# Altium project Farming_PCB.PrjPcb
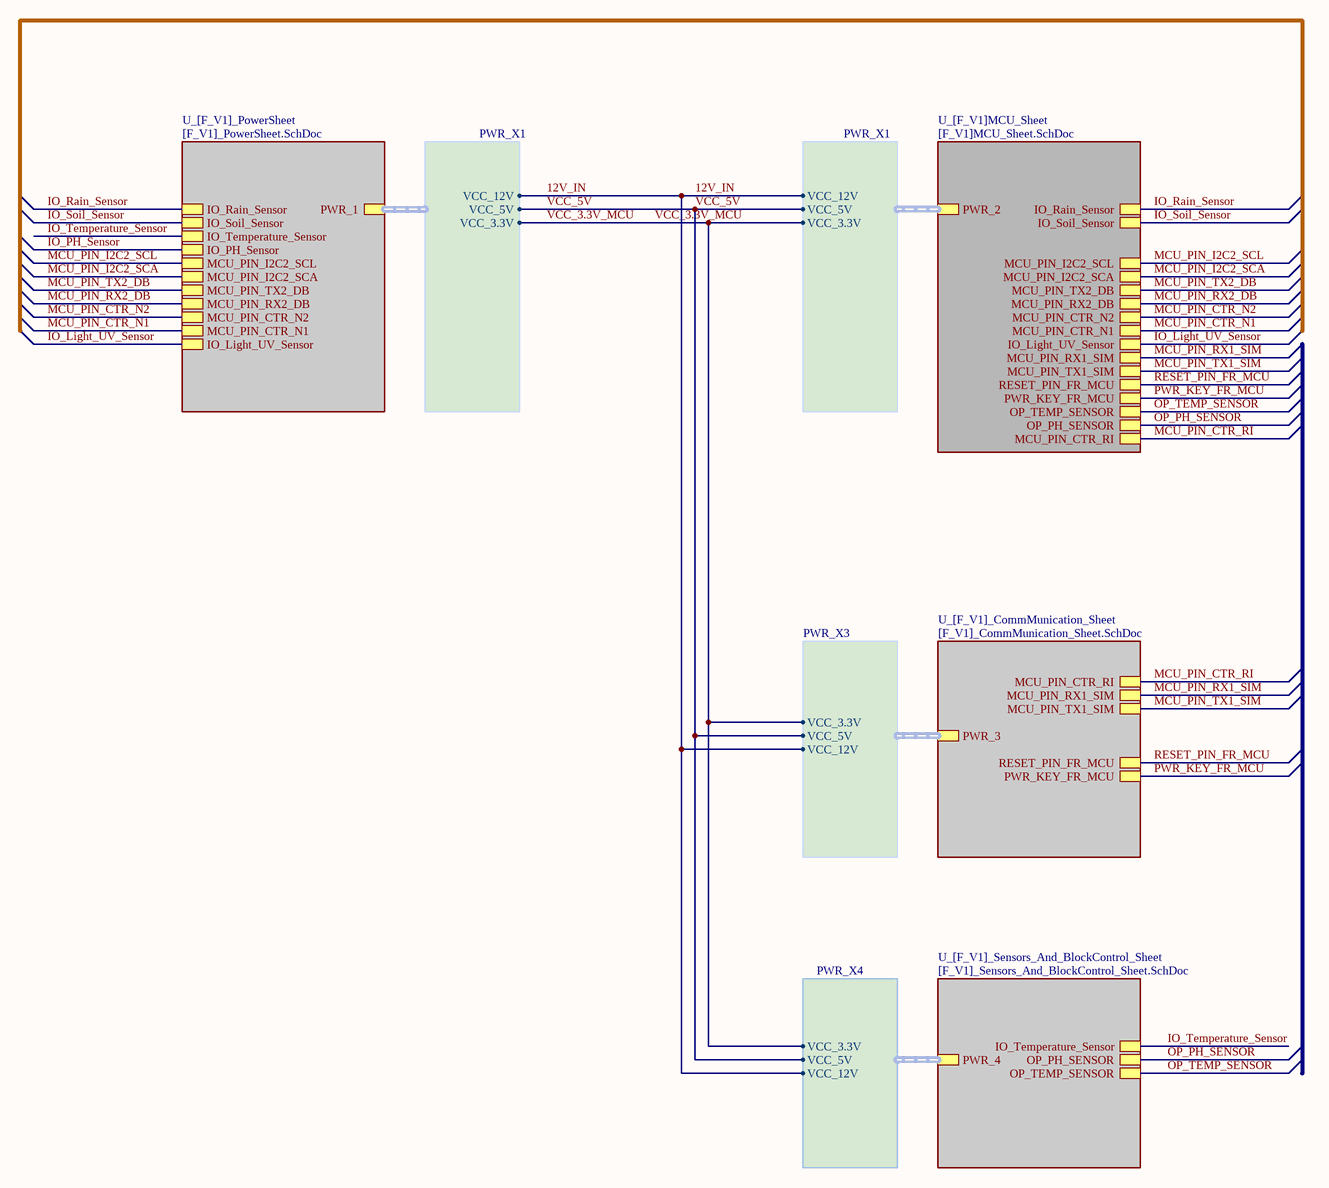
[diagram p0: Main_Sheet.SchDoc]
5 sheets, 147 parts. Net scope: hierarchical (ports join the sheet entries above them; power ports are global).
Board file: FM_V0.1.PcbDoc
Sheets:
  Main_Sheet.SchDoc
    U_[F_V1]_PowerSheet = [F_V1]_PowerSheet.SchDoc
    U_[F_V1]MCU_Sheet = [F_V1]MCU_Sheet.SchDoc
    U_[F_V1]_CommMunication_Sheet = [F_V1]_CommMunication_Sheet.SchDoc
    U_[F_V1]_Sensors_And_BlockControl_Sheet = [F_V1]_Sensors_And_BlockControl_Sheet.SchDoc

## Sheet Main_Sheet.SchDoc
size A3; SheetNumber: 1; SheetTotal: 5

### Sub-sheets
U_[F_V1]_CommMunication_Sheet = [F_V1]_CommMunication_Sheet.SchDoc: PWR_3 (harness PWR_X3), MCU_PIN_RX1_SIM, MCU_PIN_TX1_SIM, PWR_KEY_FR_MCU, RESET_PIN_FR_MCU, MCU_PIN_CTR_RI
U_[F_V1]_PowerSheet = [F_V1]_PowerSheet.SchDoc: IO_Rain_Sensor, IO_Temperature_Sensor, IO_PH_Sensor, IO_Light_UV_Sensor, PWR_1 (harness PWR_X1), IO_Soil_Sensor, MCU_PIN_CTR_N1, MCU_PIN_CTR_N2, MCU_PIN_I2C2_SCA, MCU_PIN_I2C2_SCL, MCU_PIN_TX2_DB, MCU_PIN_RX2_DB
U_[F_V1]_Sensors_And_BlockControl_Sheet = [F_V1]_Sensors_And_BlockControl_Sheet.SchDoc: PWR_4 (harness PWR_X4), IO_Temperature_Sensor, OP_PH_SENSOR, OP_TEMP_SENSOR
U_[F_V1]MCU_Sheet = [F_V1]MCU_Sheet.SchDoc: IO_Rain_Sensor, OP_TEMP_SENSOR, OP_PH_SENSOR, IO_Light_UV_Sensor, PWR_2 (harness PWR_X1), IO_Soil_Sensor, MCU_PIN_RX2_DB, MCU_PIN_I2C2_SCL, MCU_PIN_I2C2_SCA, MCU_PIN_TX2_DB, MCU_PIN_CTR_N1, MCU_PIN_CTR_N2, MCU_PIN_RX1_SIM, MCU_PIN_TX1_SIM, RESET_PIN_FR_MCU, PWR_KEY_FR_MCU, MCU_PIN_CTR_RI

### Harnesses
PWR_X1: VCC_12V, VCC_5V, VCC_3.3V
PWR_X3: VCC_12V, VCC_5V, VCC_3.3V
PWR_X4: VCC_12V, VCC_5V, VCC_3.3V

### Nets
12V_IN: sheet U_[F_V1]_PowerSheet/PWR_1.VCC_12V, sheet U_[F_V1]MCU_Sheet/PWR_2.VCC_12V, sheet U_[F_V1]_CommMunication_Sheet/PWR_3.VCC_12V, sheet U_[F_V1]_Sensors_And_BlockControl_Sheet/PWR_4.VCC_12V
IO_Light_UV_Sensor: sheet U_[F_V1]_PowerSheet/IO_Light_UV_Sensor, sheet U_[F_V1]MCU_Sheet/IO_Light_UV_Sensor
IO_PH_Sensor: sheet U_[F_V1]_PowerSheet/IO_PH_Sensor
IO_Rain_Sensor: sheet U_[F_V1]_PowerSheet/IO_Rain_Sensor, sheet U_[F_V1]MCU_Sheet/IO_Rain_Sensor
IO_Soil_Sensor: sheet U_[F_V1]_PowerSheet/IO_Soil_Sensor, sheet U_[F_V1]MCU_Sheet/IO_Soil_Sensor
IO_Temperature_Sensor: sheet U_[F_V1]_PowerSheet/IO_Temperature_Sensor, sheet U_[F_V1]_Sensors_And_BlockControl_Sheet/IO_Temperature_Sensor
MCU_PIN_CTR_N1: sheet U_[F_V1]_PowerSheet/MCU_PIN_CTR_N1, sheet U_[F_V1]MCU_Sheet/MCU_PIN_CTR_N1
MCU_PIN_CTR_N2: sheet U_[F_V1]_PowerSheet/MCU_PIN_CTR_N2, sheet U_[F_V1]MCU_Sheet/MCU_PIN_CTR_N2
MCU_PIN_CTR_RI: sheet U_[F_V1]MCU_Sheet/MCU_PIN_CTR_RI, sheet U_[F_V1]_CommMunication_Sheet/MCU_PIN_CTR_RI
MCU_PIN_I2C2_SCA: sheet U_[F_V1]_PowerSheet/MCU_PIN_I2C2_SCA, sheet U_[F_V1]MCU_Sheet/MCU_PIN_I2C2_SCA
MCU_PIN_I2C2_SCL: sheet U_[F_V1]_PowerSheet/MCU_PIN_I2C2_SCL, sheet U_[F_V1]MCU_Sheet/MCU_PIN_I2C2_SCL
MCU_PIN_RX1_SIM: sheet U_[F_V1]MCU_Sheet/MCU_PIN_RX1_SIM, sheet U_[F_V1]_CommMunication_Sheet/MCU_PIN_RX1_SIM
MCU_PIN_RX2_DB: sheet U_[F_V1]_PowerSheet/MCU_PIN_RX2_DB, sheet U_[F_V1]MCU_Sheet/MCU_PIN_RX2_DB
MCU_PIN_TX1_SIM: sheet U_[F_V1]MCU_Sheet/MCU_PIN_TX1_SIM, sheet U_[F_V1]_CommMunication_Sheet/MCU_PIN_TX1_SIM
MCU_PIN_TX2_DB: sheet U_[F_V1]_PowerSheet/MCU_PIN_TX2_DB, sheet U_[F_V1]MCU_Sheet/MCU_PIN_TX2_DB
OP_PH_SENSOR: sheet U_[F_V1]MCU_Sheet/OP_PH_SENSOR, sheet U_[F_V1]_Sensors_And_BlockControl_Sheet/OP_PH_SENSOR
OP_TEMP_SENSOR: sheet U_[F_V1]MCU_Sheet/OP_TEMP_SENSOR, sheet U_[F_V1]_Sensors_And_BlockControl_Sheet/OP_TEMP_SENSOR
PWR_KEY_FR_MCU: sheet U_[F_V1]MCU_Sheet/PWR_KEY_FR_MCU, sheet U_[F_V1]_CommMunication_Sheet/PWR_KEY_FR_MCU
RESET_PIN_FR_MCU: sheet U_[F_V1]MCU_Sheet/RESET_PIN_FR_MCU, sheet U_[F_V1]_CommMunication_Sheet/RESET_PIN_FR_MCU
VCC_3.3V_MCU: sheet U_[F_V1]_PowerSheet/PWR_1.VCC_3.3V, sheet U_[F_V1]MCU_Sheet/PWR_2.VCC_3.3V, sheet U_[F_V1]_CommMunication_Sheet/PWR_3.VCC_3.3V, sheet U_[F_V1]_Sensors_And_BlockControl_Sheet/PWR_4.VCC_3.3V
VCC_5V: sheet U_[F_V1]_PowerSheet/PWR_1.VCC_5V, sheet U_[F_V1]MCU_Sheet/PWR_2.VCC_5V, sheet U_[F_V1]_CommMunication_Sheet/PWR_3.VCC_5V, sheet U_[F_V1]_Sensors_And_BlockControl_Sheet/PWR_4.VCC_5V  [project net VBATT]

## Sheet [F_V1]_PowerSheet.SchDoc
size A2; SheetNumber: 2; SheetTotal: 5
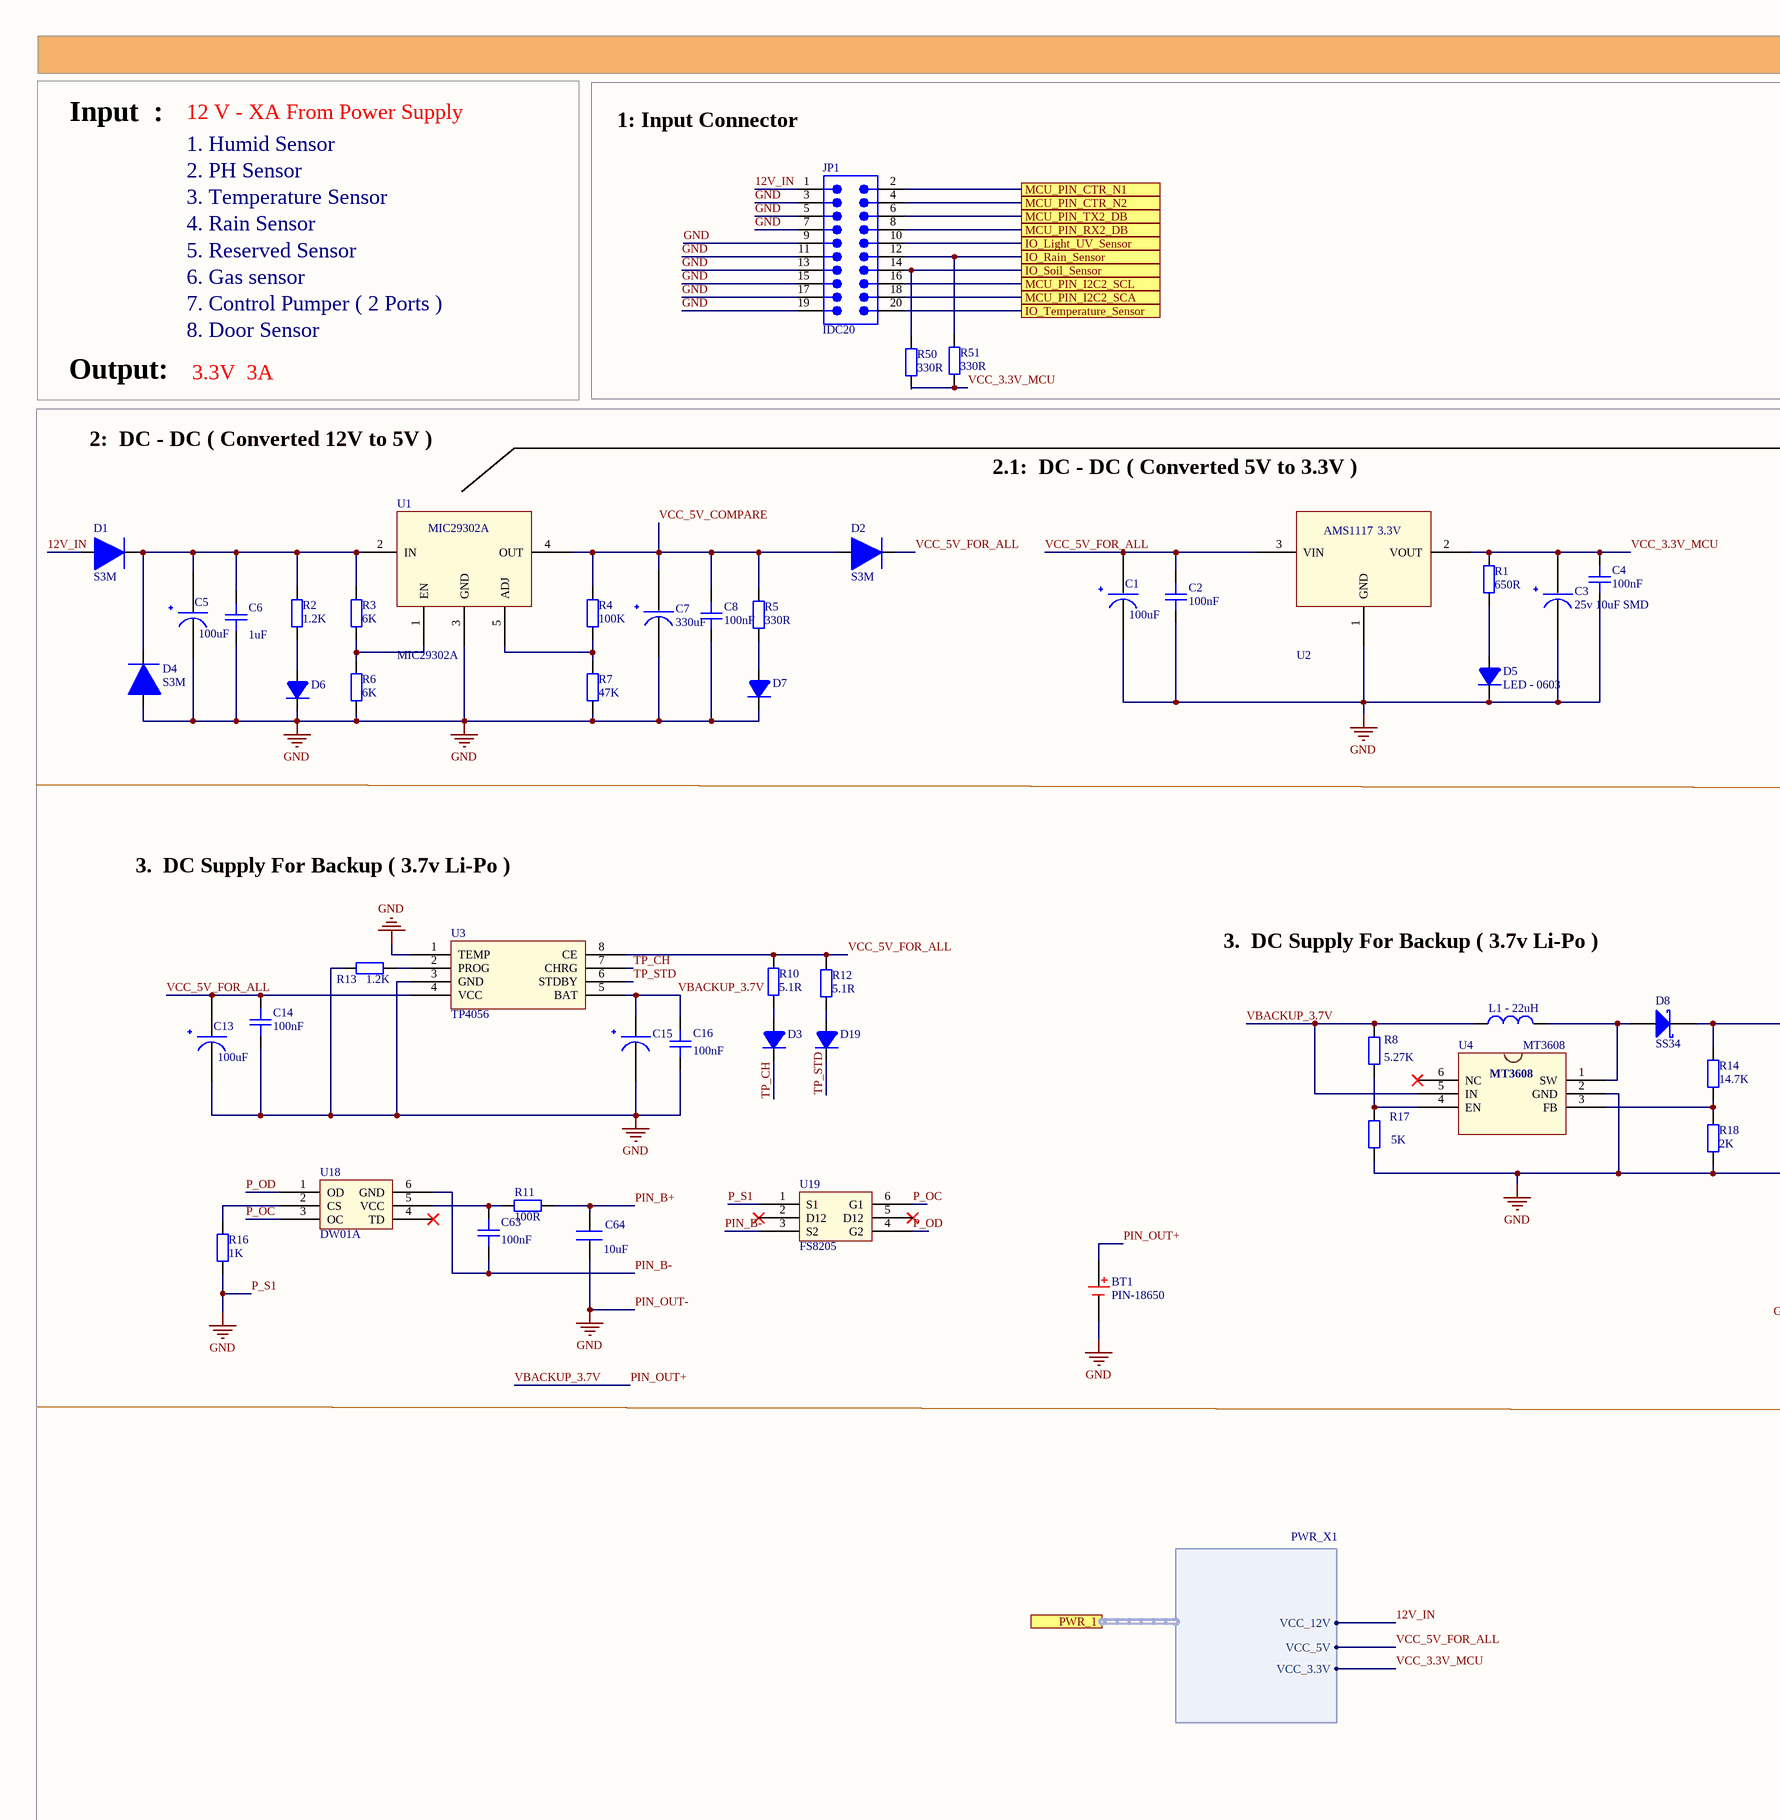
[diagram p1: [F_V1]_PowerSheet.SchDoc, left]
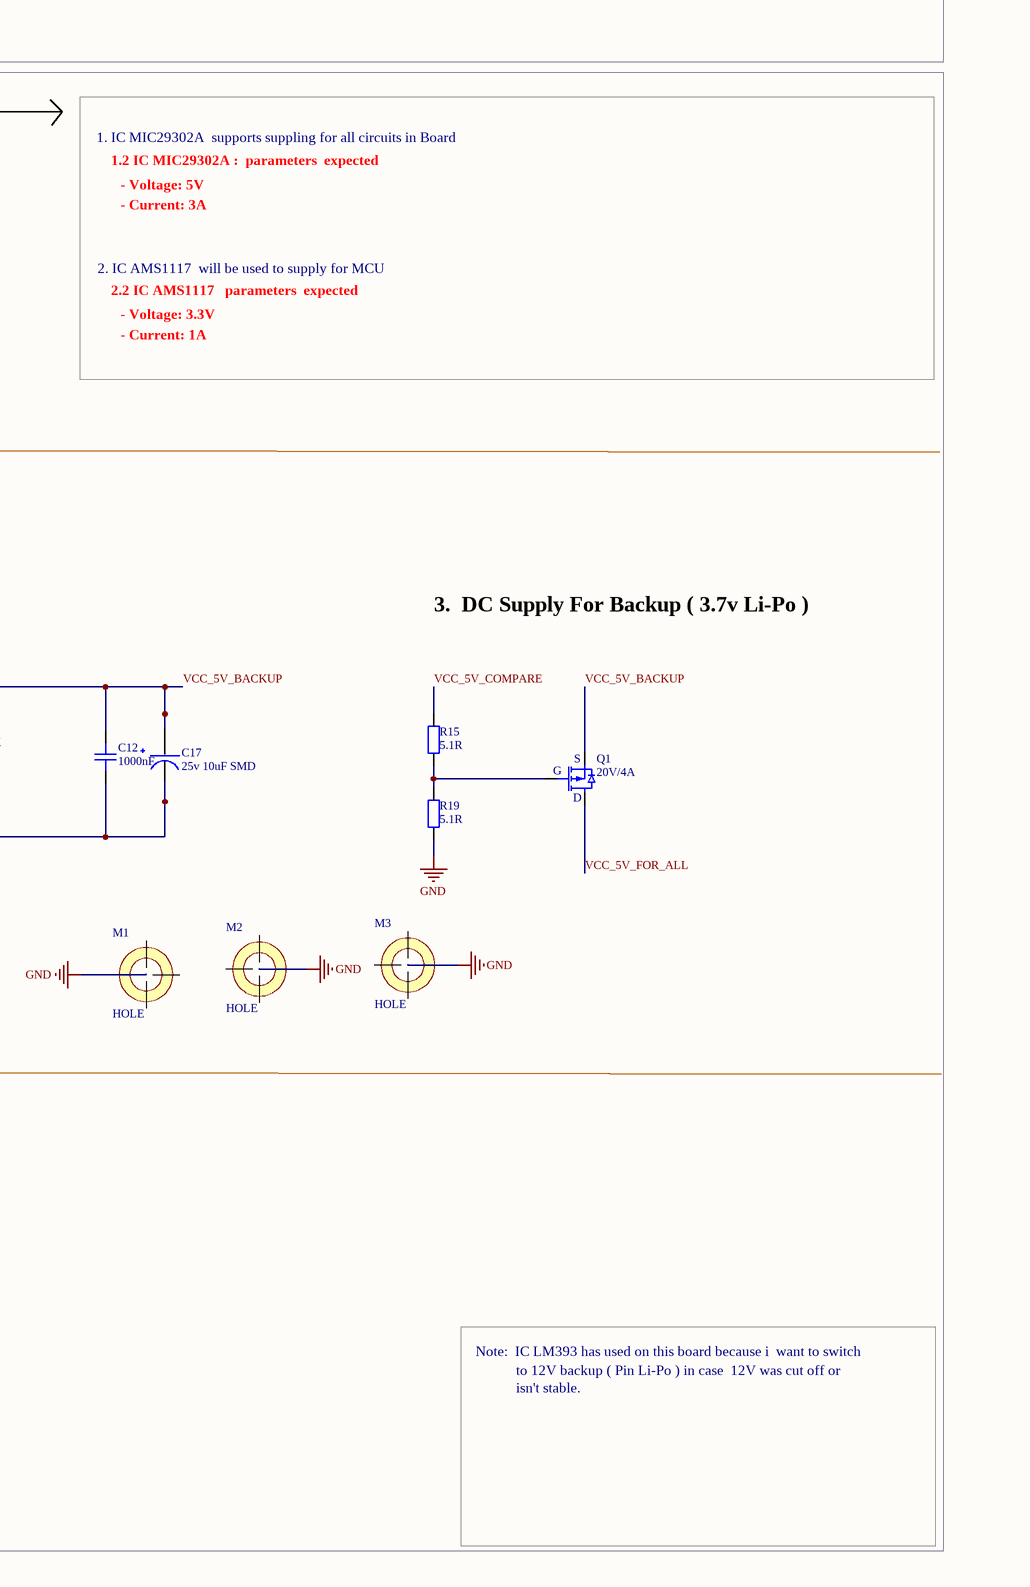
[diagram p2: [F_V1]_PowerSheet.SchDoc, right]

### Parts
(Parts that share a designator on the sheet are numbered #1, #2 ... from top to bottom, then left to right.)
BT1  PIN-18650  [PIN]
C1  100uF  [CAPACITOR 6.3x7.7mm]
C2  100nF  [CAPC-0603 (1608)]
C3  25v 10uF SMD  [CAPACITOR 4x5.4mm]
C4  100nF  [CAPC-0603 (1608)]
C5  100uF  [CAPACITOR 6.3x7.7mm]
C6  1uF  [CAPC-0603 (1608)]
C7  330uF  [CAPACITOR 8x10mm SMD]
C8  100nF  [CAPC-0603 (1608)]
C12  1000nF  [CAPC-0603 (1608)]
C13  100uF  [CAPACITOR 6.3x7.7mm]
C14  100nF  [CAPC-0603 (1608)]
C15  25v 10uF SMD  [CAPACITOR 4x5.4mm]  (value not drawn)
C16  100nF  [CAPC-0603 (1608)]
C17  25v 10uF SMD  [CAPACITOR 4x5.4mm]
C63  100nF  [CAPC-0603 (1608)]
C64  10uF  [CAP 10uF SMD 0805]
D1  S3M  [S3M]
D2  S3M  [S3M]
D3  LED - 0603  [LED - 0603]  (value not drawn)
D4  S3M  [S3M]
D5  LED - 0603  [LED - 0603]
D6  LED - 0603  [LED - 0603]  (value not drawn)
D7  LED - 0603  [LED - 0603]  (value not drawn)
D8  SS34  [DIODE_DO214AC_SMA]
D19  LED - 0603  [LED - 0603]  (value not drawn)
JP1#1  IDC20  [CAPBLE 20]
L1_-_22uH  L-22uH-0530  [INDUCTOR-0630-SMD]  (value not drawn)
M1  HOLE  [HOLE_2MM_5MM]  (no BOM)
M2  HOLE  [HOLE_2MM_5MM]  (no BOM)
M3  HOLE  [HOLE_2MM_5MM]  (no BOM)
Q1  20V/4A  [SOT23_3]
R1  650R  [RESC-0603 (1608)]
R2  1.2K  [RESC-0603 (1608)]
R3  6K  [RESC-0603 (1608)]
R4  100K  [RESC-0603 (1608)]
R5  330R  [RESC-0603 (1608)]
R6  6K  [RESC-0603 (1608)]
R7  47K  [RESC-0603 (1608)]
R8  5.27K  [RESC-0603 (1608)]
R10  5.1R  [RESC-0603 (1608)]
R11  100R  [RESC-0603 (1608)]
R12  5.1R  [RESC-0603 (1608)]
R13  1.2K  [RESC-0603 (1608)]
R14  14.7K  [RESC-0603 (1608)]
R15  5.1R  [RESC-0603 (1608)]
R16  1K  [RESC-0603 (1608)]
R17  5K  [RESC-0603 (1608)]
R18  2K  [RESC-0603 (1608)]
R19  5.1R  [RESC-0603 (1608)]
R50  330R  [RESC-0603 (1608)]
R51  330R  [RESC-0603 (1608)]
U1  MIC29302A  [MIC29302A]
U2  AMS1117 - 3.3V  [AMS1117 -3.3V]  (value not drawn)
U3  TP4056  [TP4056]
U4  MT3608  [MT3608]
U18  DW01A  [DW01A]
U19  FS8205  [FS8205]

### Blocks framed on the sheet
1: Input Connector: JP1#1 R50 R51

### Ports
IO_Light_UV_Sensor, IO_Rain_Sensor, IO_Soil_Sensor, IO_Temperature_Sensor, MCU_PIN_CTR_N1, MCU_PIN_CTR_N2, MCU_PIN_I2C2_SCA, MCU_PIN_I2C2_SCL, MCU_PIN_RX2_DB, MCU_PIN_TX2_DB, PWR_1 (harness PWR_X1)

### Harnesses
PWR_X1: VCC_12V, VCC_5V, VCC_3.3V

### Nets
GND: BT1.2 C1.2 C2.1 C3.2 C4.1 C5.2 C6.1 C7.2 C8.1 C12.1 C13.2 C14.1 C15.2 C16.1 C17.2 C64.1 D4.1(A) D5.2(K) D6.2(K) D7.2(K) JP1#1.3 JP1#1.5 JP1#1.7 JP1#1.9 JP1#1.11 JP1#1.13 JP1#1.15 JP1#1.17 JP1#1.19 R6.1 R7.1 R13.1 R16.2 R17.2 R18.2 R19.1 U1.3(GND) U2.1(GND) U3.1(TEMP) U3.3(GND) U4.2(GND) U19.1(S1)  [also labelled P_S1, PIN_OUT-]
12V_IN: D1.1(A) JP1#1.1 ; port PWR_1.VCC_12V
IO_Light_UV_Sensor: JP1#1.10 ; port IO_Light_UV_Sensor
IO_Rain_Sensor: JP1#1.12 R51.2 ; port IO_Rain_Sensor
IO_Soil_Sensor: JP1#1.14 R50.2 ; port IO_Soil_Sensor
IO_Temperature_Sensor: JP1#1.20 ; port IO_Temperature_Sensor
MCU_PIN_CTR_N1: JP1#1.2 ; port MCU_PIN_CTR_N1
MCU_PIN_CTR_N2: JP1#1.4 ; port MCU_PIN_CTR_N2
MCU_PIN_I2C2_SCA: JP1#1.18 ; port MCU_PIN_I2C2_SCA
MCU_PIN_I2C2_SCL: JP1#1.16 ; port MCU_PIN_I2C2_SCL
MCU_PIN_RX2_DB: JP1#1.8 ; port MCU_PIN_RX2_DB
MCU_PIN_TX2_DB: JP1#1.6 ; port MCU_PIN_TX2_DB
P_OC: U18.3(OC) U19.6(G1)
P_OD: U18.1(OD) U19.4(G2)
PIN_B+: C64.2 R11.2
PIN_B-: C63.1 U18.6(GND) U19.3(S2)
PIN_OUT+: BT1.1 C15.1 C16.2 L1_-_22uH.1 R8.1 U3.5(BAT) U4.5(IN)  [also labelled VBACKUP_3.7V]
TP_CH: D3.2(K) U3.7(CHRG)
TP_STD: D19.2(K) U3.6(STDBY)
VCC_3.3V_MCU: C3.1 C4.2 R1.2 R50.1 R51.1 U2.2(VOUT) ; port PWR_1.VCC_3.3V
VCC_5V_BACKUP: C12.2 C17.1 D8.2(K) Q1.2(S) R14.1
VCC_5V_COMPARE: C7.1 C8.2 D2.1(A) R4.1 R5.2 R15.1 U1.4(OUT)
VCC_5V_FOR_ALL: C1.1 C2.2 C13.1 C14.2 D2.2(K) Q1.3(D) R10.2 R12.2 U2.3(VIN) U3.4(VCC) U3.8(CE) ; port PWR_1.VCC_5V  [project net VBATT]
NetC5_1: C5.1 C6.2 D1.2(K) D4.2(K) R2.2 R3.1 U1.2(IN)
NetC63_2: C63.2 R11.1 U18.5(VCC)
NetD3_1: D3.1(A) R10.1
NetD5_1: D5.1(A) R1.1
NetD6_1: D6.1(A) R2.1
NetD7_1: D7.1(A) R5.1
NetD8_1: D8.1(A) L1_-_22uH.2 U4.1(SW)
NetD19_1: D19.1(A) R12.1
NetQ1_1: Q1.1(G) R15.2 R19.2
NetR3_2: R3.2 R6.2 U1.1(EN)
NetR4_2: R4.2 R7.2 U1.5(ADJ)
NetR8_2: R8.2 R17.1 U4.4(EN)
NetR13_2: R13.2 U3.2(PROG)
NetR14_2: R14.2 R18.1 U4.3(FB)
NetR16_1: R16.1 U18.2(CS)

Not connected (* = marked no-connect by the designer): U4 6(NC)*; U18 4(TD)*; U19 2(D12)* 5(D12)*

### Notes on the sheet
- Input  :
- 12 V - XA From Power Supply
- 1. Humid Sensor
- 2. PH Sensor
- 3. Temperature Sensor
- 4. Rain Sensor
- 5. Reserved Sensor
- 6. Gas sensor
- 7. Control Pumper ( 2 Ports )
- Output:
- 8. Door Sensor
- 3.3V  3A
- 2:  DC - DC ( Converted 12V to 5V )
- 2.1:  DC - DC ( Converted 5V to 3.3V )
- 1. IC MIC29302A  supports suppling for all circuits in Board
- 1.2 IC MIC29302A :  parameters  expected
- - Voltage: 5V
- - Current: 3A
- 2. IC AMS1117  will be used to supply for MCU
- 2.2 IC AMS1117   parameters  expected
- - Voltage: 3.3V
- - Current: 1A
- 3.  DC Supply For Backup ( 3.7v Li-Po )
- Note:  IC LM393 has used on this board because i  want to switch
- to 12V backup ( Pin Li-Po ) in case  12V was cut off or
- isn't stable.
- (in symbol AMS1117 - 3.3V) AMS1117; 3.3V

### Library data of the parts
C1 C5 C13 = 25V 100uF SMD
C2 C4 C6 C8 C12 C14 C16 C63 = CAPC NF 0603: CAP SMD, Not Fill, 0603; Value: NF; Solder: Not Fill; Category: CAPACITOR
C7 = 25V 330uF SMD
C64 = CAP 0805 10uF SMD
D8 = SS34: DIODE SCHOTTKY 40V 3A SMA; Solder: SMT; MPN: SS34; Value: SS34; MFR: *
JP1#1 = CAPBLE 20: Flat Cable Connector (IDC), Standard Male Header, Straight Press-in Pin, 20 Contacts, Performance Level 2; PCB_Layout: Complies with manufacturer's recommendation.; DrillSize: Corresponds to nominal value.; Published: 15-Nov-2004; PackageDocument: Feb-2000; PackageReference: 918520x329; Publisher: Altium Limited; ComponentLink1Description: Manufacturer Link; ComponentLink1URL: http://www.harting.com/; ComponentLink2Description: Packaging Specification; ComponentLink2URL: http://www.harkis.harting.com/_sek/pdf/TB_0918520x329_BL01_R32154.pdf
M1-M3 = HOLE_2_4/2_5/3_5/3_6: HOLE 2_4/2_5/3_5/3_6; MPN: None; Solder: Not Fill; CompanyID: VT-; ClassName: MECH_HOLE; Value: HOLE
Q1 = AO3415: MOSFET P-CH 20V 4A SOT23; MFR: Alpha & Omega Semiconductor Inc.; Solder: SMT; Value: 20V/4A; MPN: AO3415
R1-R8 R11 R13 R14 R16-R18 R50 R51 = CRCW06035R10FKEA: RES SMD 5.1 OHM 1% 1/10W 0603; MFR: Vishay Dale; Value: 5.1R; Solder: SMT; MPN: CRCW06035R10FKEA; Category: RESISTOR; PinCount: 2
R10 R12 R15 R19 = CRCW06035R10FKEA: RES SMD 5.1 OHM 1% 1/10W 0603; MFR: Vishay Dale; Solder: SMT; Value: 5.1R; MPN: CRCW06035R10FKEA; Category: RESISTOR; PinCount: 2

## Sheet [F_V1]MCU_Sheet.SchDoc
size A2; SheetNumber: 3; SheetTotal: 5
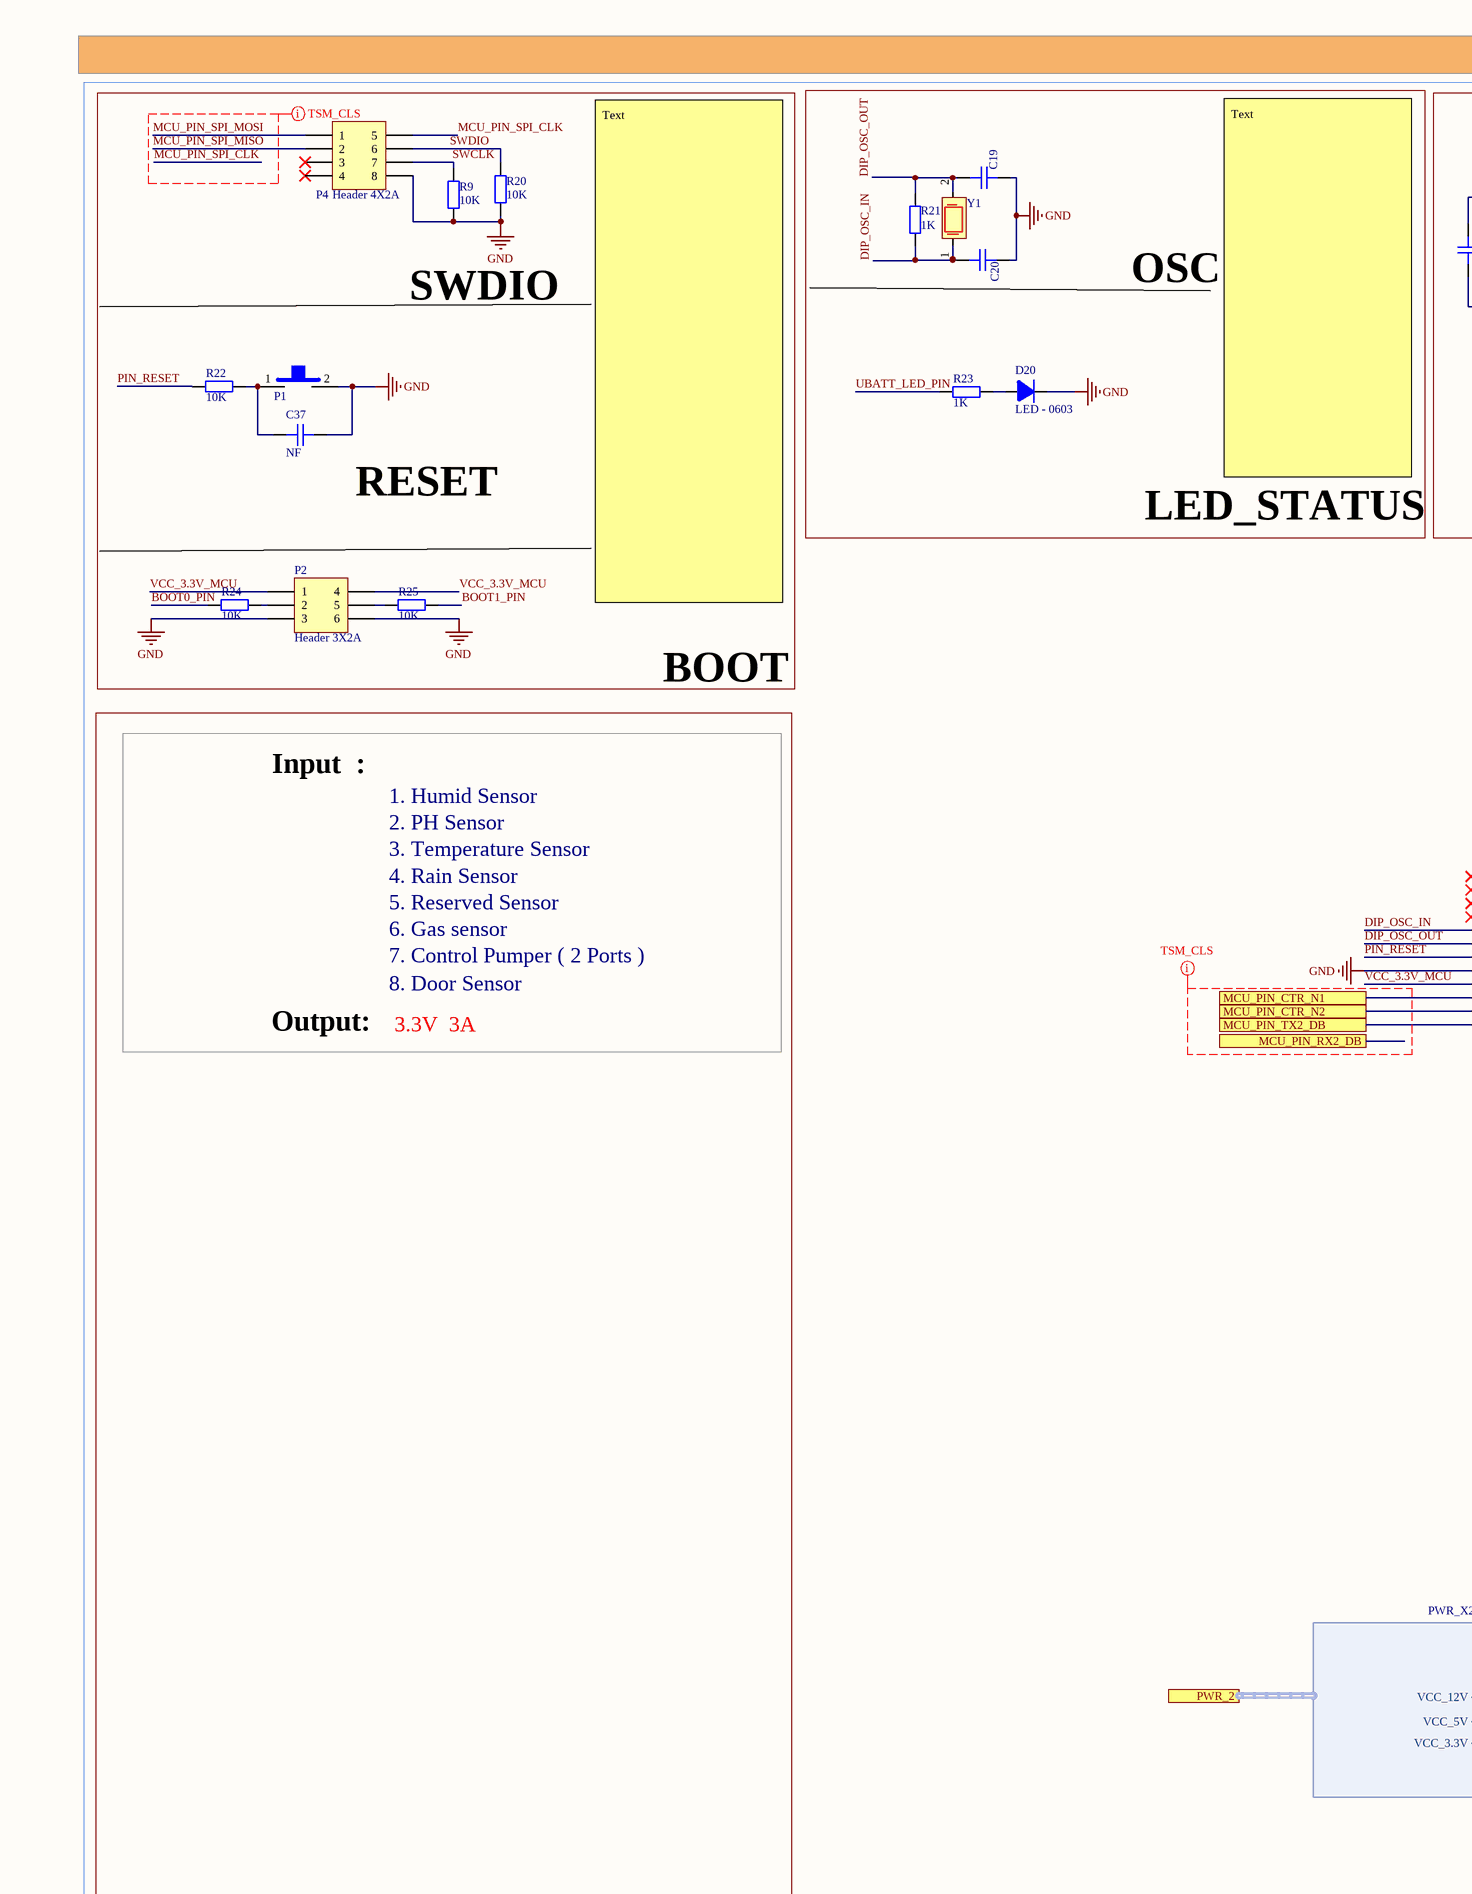
[diagram p3: [F_V1]MCU_Sheet.SchDoc, left]
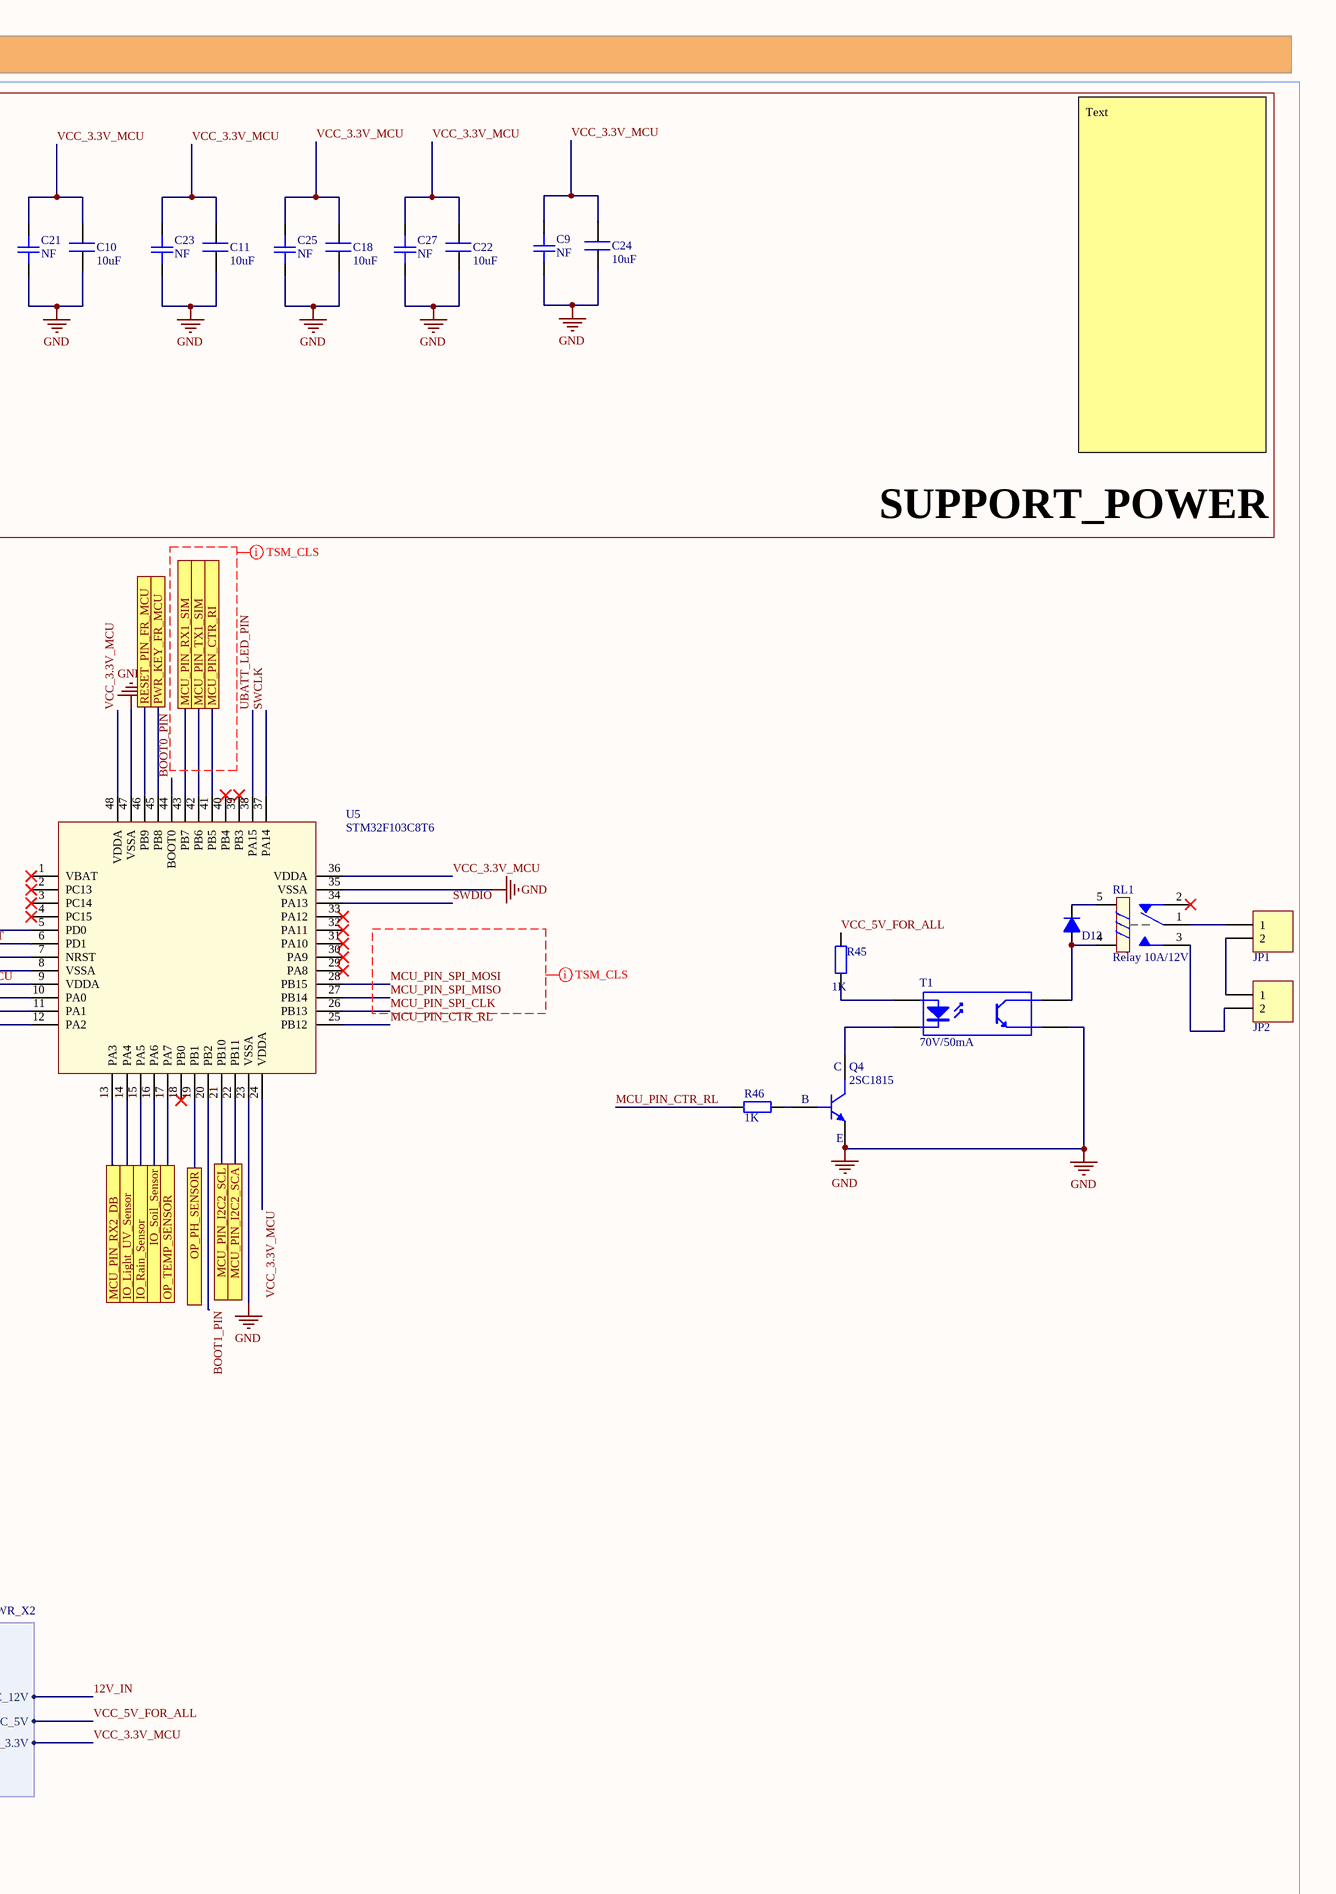
[diagram p4: [F_V1]MCU_Sheet.SchDoc, right]

### Parts
(Parts that share a designator on the sheet are numbered #1, #2 ... from top to bottom, then left to right.)
C9  NF  [CAPC-0603 (1608)]
C10  10uF  [CAP 10uF SMD 0805]
C11  10uF  [CAP 10uF SMD 0805]
C18  10uF  [CAP 10uF SMD 0805]
C19  NF  [CAPC-0603 (1608)]  (value not drawn)
C20  NF  [CAPC-0603 (1608)]  (value not drawn)
C21  NF  [CAPC-0603 (1608)]
C22  10uF  [CAP 10uF SMD 0805]
C23  NF  [CAPC-0603 (1608)]
C24  10uF  [CAP 10uF SMD 0805]
C25  NF  [CAPC-0603 (1608)]
C27  NF  [CAPC-0603 (1608)]
C37  NF  [CAPC-0603 (1608)]
D12  Diode  1N4007  [DO-214AC]  (value not drawn)
D20  LED - 0603  [LED - 0603]
JP1#2  Header 2_1  [HED2]  (value not drawn)
JP2  Header 2_1  [HED2]  (value not drawn)
P1  (no value)  [SW 2P SMD]
P2  Header 3X2A  [HDR2X3_CEN]
P4  Header 4X2A  [HDR2X4_CEN]
Q4  2SC1815  [SOT23_3]
R9  10K  [RESC-0603 (1608)]
R20  10K  [RESC-0603 (1608)]
R21  1K  [RESC-0603 (1608)]
R22  10K  [RESC-0603 (1608)]
R23  1K  [RESC-0603 (1608)]
R24  10K  [RESC-0603 (1608)]
R25  10K  [RESC-0603 (1608)]
R45  1K  [RESC-0603 (1608)]
R46  1K  [RESC-0603 (1608)]
RL1  Relay 10A/12V  [RL_SPDT_10A]
T1  70V/50mA  [OPTO TRANSISTOR_SMD-4]
U5  STM32F103C8T6  [STM32F103C8T6]
Y1  CRYSTAL - 8MHZ  [CRYSTAL - 8Mhz]  (value not drawn)

### Blocks framed on the sheet
SUPPORT_POWER: C9-C11 C18 C21-C25 C27

### Ports
IO_Light_UV_Sensor, IO_Rain_Sensor, IO_Soil_Sensor, MCU_PIN_CTR_N1, MCU_PIN_CTR_N2, MCU_PIN_CTR_RI, MCU_PIN_I2C2_SCA, MCU_PIN_I2C2_SCL, MCU_PIN_RX1_SIM, MCU_PIN_RX2_DB, MCU_PIN_TX1_SIM, MCU_PIN_TX2_DB, OP_PH_SENSOR, OP_TEMP_SENSOR, PWR_2 (harness PWR_X2), PWR_KEY_FR_MCU, RESET_PIN_FR_MCU

### Harnesses
PWR_X2: VCC_12V, VCC_5V, VCC_3.3V

### Nets
GND: C9.1 C10.1 C11.1 C18.1 C19.1 C20.1 C21.1 C22.1 C23.1 C24.1 C25.1 C27.1 C37.1 D20.2(K) P1.2 P2.3 P2.6 P4.8 Q4.2(E) R9.2 R20.2 T1.3 U5.8(VSSA) U5.23(VSSA) U5.35(VSSA) U5.47(VSSA)
BOOT0_PIN: R24.1 U5.44(BOOT0)
BOOT1_PIN: R25.2 U5.20(PB2)
DIP_OSC_IN: C20.2 R21.2 U5.5(PD0) Y1.1
DIP_OSC_OUT: C19.2 R21.1 U5.6(PD1) Y1.2
IO_Light_UV_Sensor: U5.14(PA4) ; port IO_Light_UV_Sensor
IO_Rain_Sensor: U5.15(PA5) ; port IO_Rain_Sensor
IO_Soil_Sensor: U5.16(PA6) ; port IO_Soil_Sensor
MCU_PIN_CTR_N1: U5.10(PA0) ; port MCU_PIN_CTR_N1
MCU_PIN_CTR_N2: U5.11(PA1) ; port MCU_PIN_CTR_N2
MCU_PIN_CTR_RI: U5.41(PB5) ; port MCU_PIN_CTR_RI
MCU_PIN_CTR_RL: R46.1 U5.25(PB12)
MCU_PIN_I2C2_SCA: U5.22(PB11) ; port MCU_PIN_I2C2_SCA
MCU_PIN_I2C2_SCL: U5.21(PB10) ; port MCU_PIN_I2C2_SCL
MCU_PIN_RX1_SIM: U5.43(PB7) ; port MCU_PIN_RX1_SIM
MCU_PIN_RX2_DB: U5.13(PA3) ; port MCU_PIN_RX2_DB
MCU_PIN_SPI_CLK: P4.5 U5.26(PB13)
MCU_PIN_SPI_MISO: P4.2 U5.27(PB14)
MCU_PIN_SPI_MOSI: P4.1 U5.28(PB15)
MCU_PIN_TX1_SIM: U5.42(PB6) ; port MCU_PIN_TX1_SIM
MCU_PIN_TX2_DB: U5.12(PA2) ; port MCU_PIN_TX2_DB
OP_PH_SENSOR: U5.19(PB1) ; port OP_PH_SENSOR
OP_TEMP_SENSOR: U5.17(PA7) ; port OP_TEMP_SENSOR
PIN_RESET: R22.1 U5.7(NRST)
PWR_KEY_FR_MCU: U5.45(PB8) ; port PWR_KEY_FR_MCU
RESET_PIN_FR_MCU: U5.46(PB9) ; port RESET_PIN_FR_MCU
SWCLK: P4.7 R9.1 U5.37(PA14)
SWDIO: P4.6 R20.1 U5.34(PA13)
UBATT_LED_PIN: R23.1 U5.38(PA15)
VCC_3.3V_MCU: C9.2 C10.2 C11.2 C18.2 C21.2 C22.2 C23.2 C24.2 C25.2 C27.2 P2.1 P2.4 U5.9(VDDA) U5.24(VDDA) U5.36(VDDA) U5.48(VDDA) ; port PWR_2.VCC_3.3V
VCC_5V_FOR_ALL: R45.1 ; port PWR_2.VCC_5V  [project net VBATT]
NetC37_2: C37.2 P1.1 R22.2
NetD12_A: D12.A RL1.4 T1.4
NetD12_K: D12.K RL1.5
NetD20_1: D20.1(A) R23.2
NetJP1#2_1: JP1#2.1 RL1.1
NetJP1#2_2: JP1#2.2 JP2.1
NetJP2_2: JP2.2 RL1.3
NetP2_2: P2.2 R24.2
NetP2_5: P2.5 R25.1
NetQ4_1: Q4.1(B) R46.2
NetQ4_3: Q4.3(C) T1.2
NetR45_2: R45.2 T1.1

Not connected (* = marked no-connect by the designer): P4 3* 4*; RL1 2*; U5 1(VBAT)* 2(PC13)* 3(PC14)* 4(PC15)* 18(PB0)* 29(PA8)* 30(PA9)* 31(PA10)* 32(PA11)* 33(PA12)* 39(PB3)* 40(PB4)*

### Layout directives
net class TSM_CLS: (no net found under the mark), MCU_PIN_SPI_CLK, MCU_PIN_SPI_MISO, MCU_PIN_SPI_MOSI

### Notes on the sheet
- OSC
- SWDIO
- Text
- (near C37) RESET
- LED_STATUS
- BOOT
- Input  :
- 1. Humid Sensor
- 2. PH Sensor
- 3. Temperature Sensor
- 4. Rain Sensor
- 5. Reserved Sensor
- 6. Gas sensor
- 7. Control Pumper ( 2 Ports )
- Output:
- 8. Door Sensor
- 3.3V  3A

### Library data of the parts
C9 C19-C21 C23 C25 C27 C37 = CAPC NF 0603: CAP SMD, Not Fill, 0603; Solder: Not Fill; Value: NF; Category: CAPACITOR
C10 C11 C18 C22 C24 = CAP 0805 10uF SMD
D12 = Diode  1N4007: Diode 1A; Value: 1N4007
JP1#2 JP2 = Header 2_1: Header, 2-Pin; Manufacturer: Generic Components; Class: Connector; Value: Header 2
P1 = Button 2 SMD: SMD Mini Push Button Switch 2 Pin 3x6x2.7mm; MPN: SMD Mini Push Button 2 SMD; Link: https://ram-e-shop.com/product/press2pin-smd/
P2 = Header 3X2A: Header, 3-Pin, Dual row; LatestRevisionDate: 17-Jul-2002; LatestRevisionNote: Re-released for DXP Platform.; Publisher: Altium Limited
P4 = Header 4X2A: Header, 4-Pin, Dual row; Solder: WAVE
Q4 = 2SC1815: TRANS NPN 50V 0.15A SOT23-3; Solder: SMT; MPN: 2SC1815; Value: 2SC1815
R9 R20-R25 R45 R46 = CRCW06035R10FKEA: as R1 on sheet [F_V1]_PowerSheet; MPN: CRCW06035R10FKEA; Category: RESISTOR; PinCount: 2
RL1 = Relay 1: Relay SPDT,10A - 12VDC 5 Pin; Value: Relay SPDT, 10A, 12V
T1 = HCPL-817-500E: OPTOISOLATOR 5KV TRANSISTOR 4SMD; Solder: SMT; CompanyID: VT-00147; Value: 70V/50mA; MPN: HCPL-817-500E

## Sheet [F_V1]_CommMunication_Sheet.SchDoc
size A2; SheetNumber: 4; SheetTotal: 5
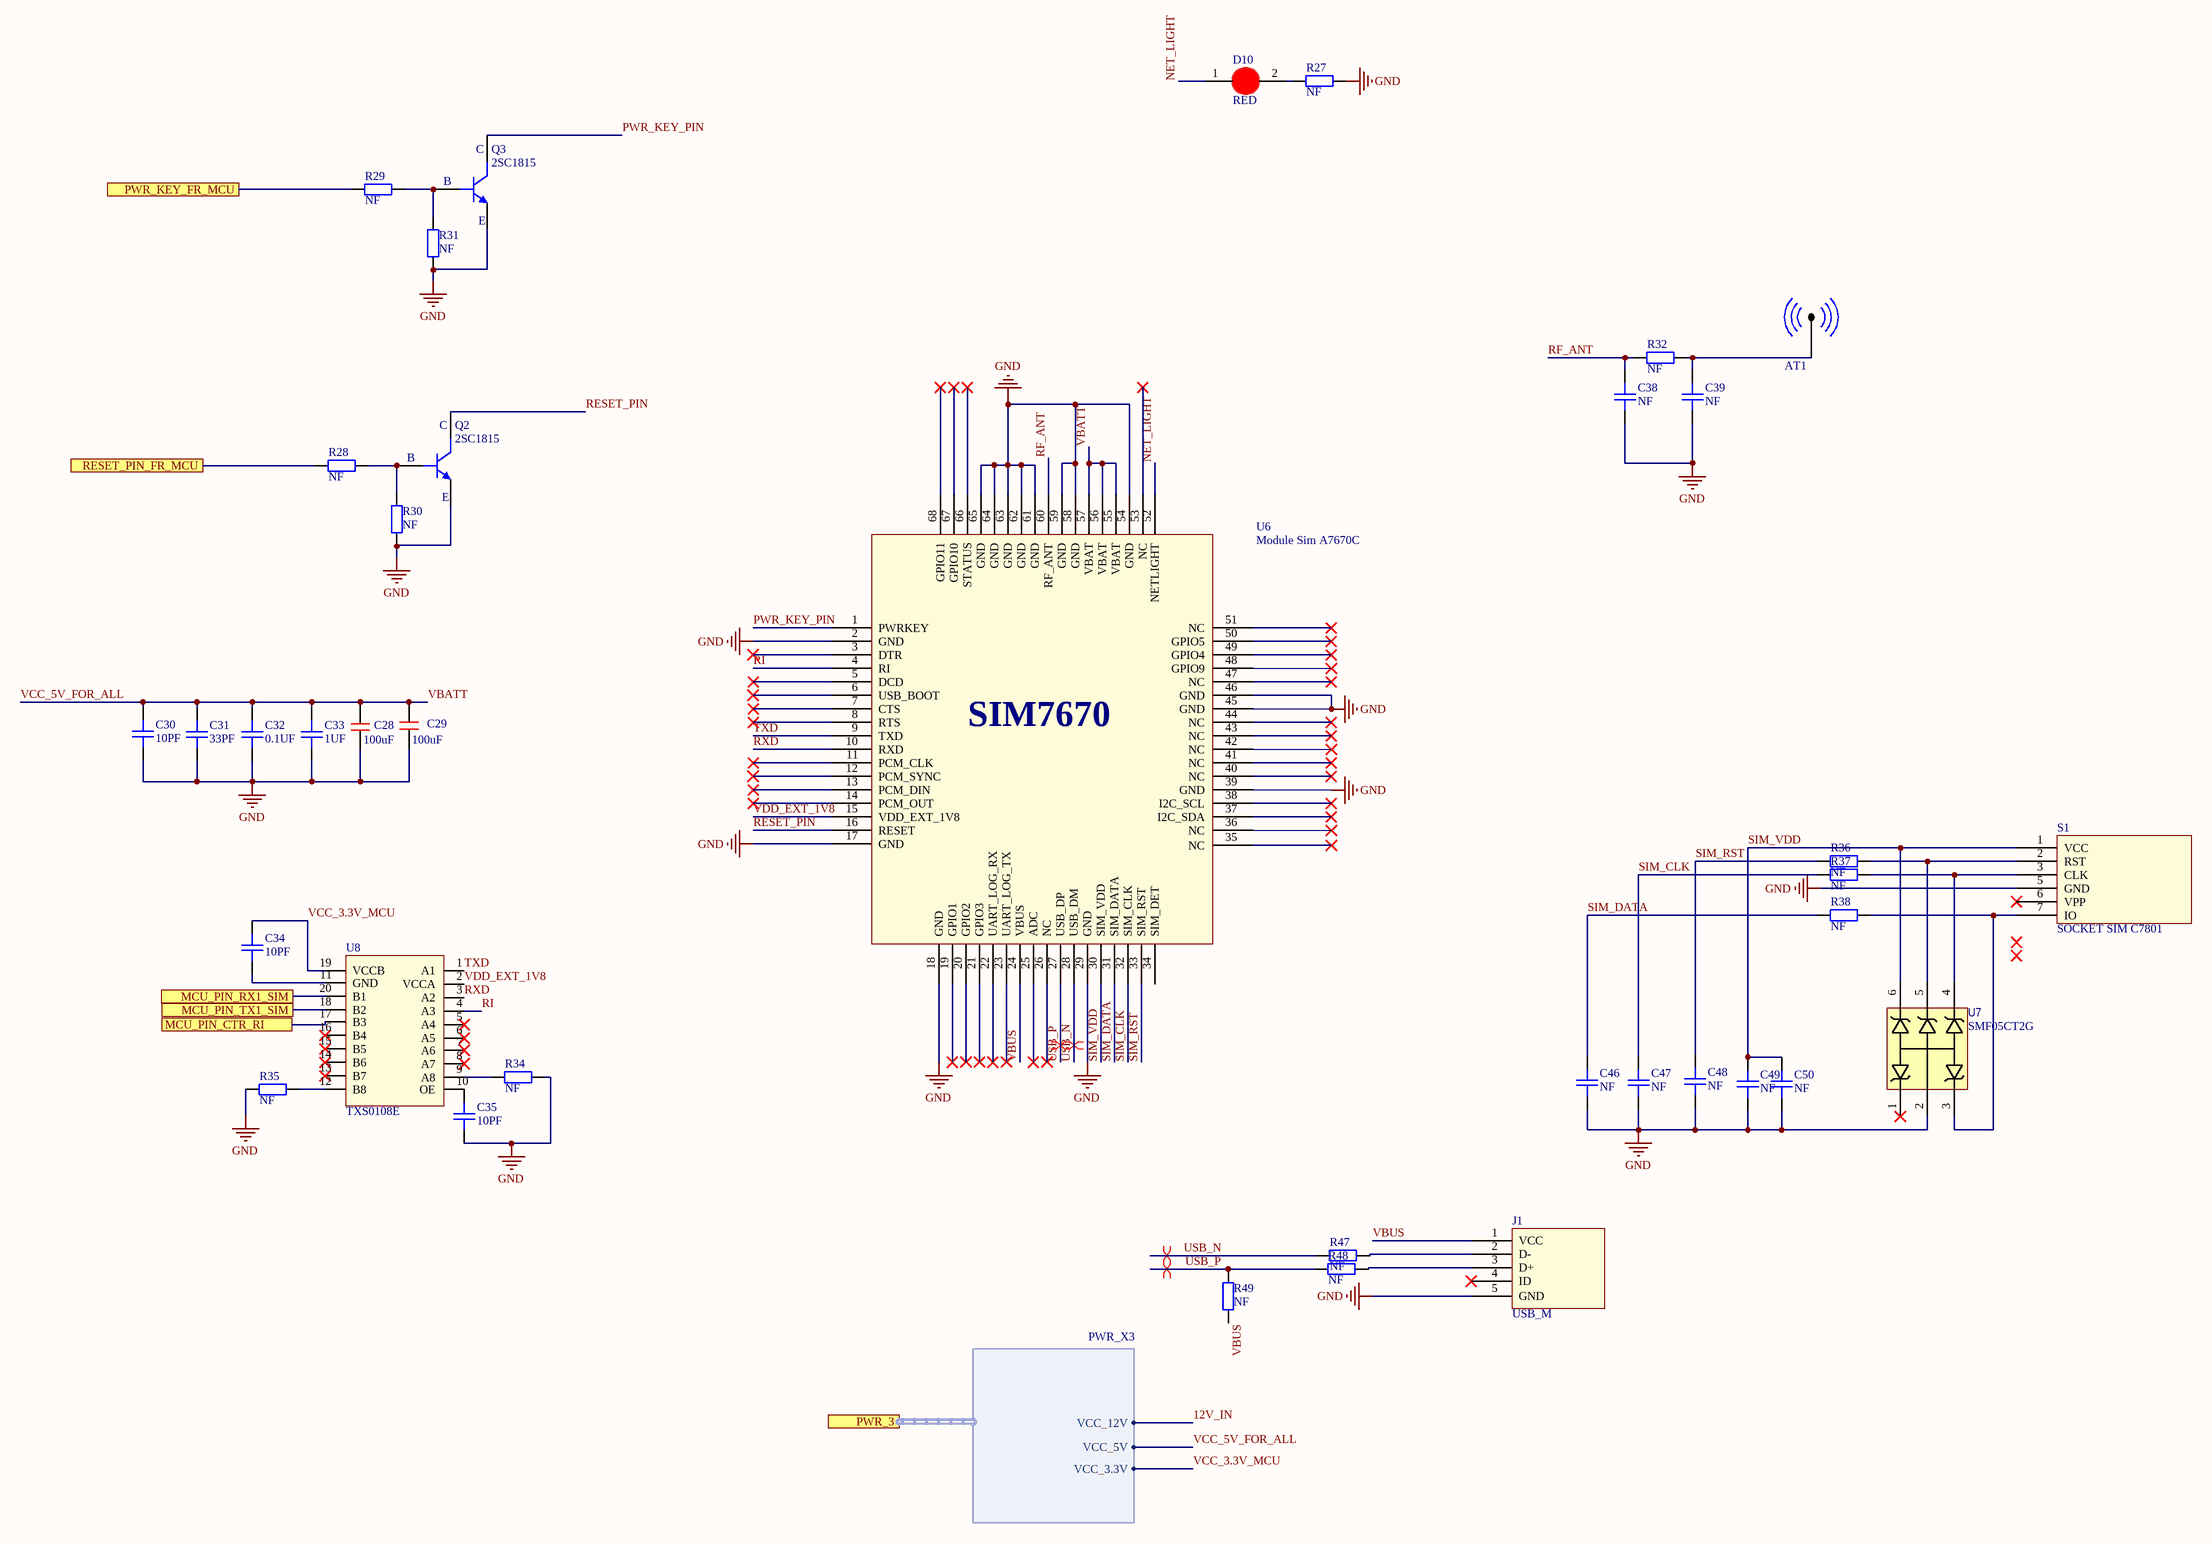
[diagram p5: [F_V1]_CommMunication_Sheet.SchDoc]

### Parts
AT1  AT-GSM-GPS  [ANTENA - SMA2]  (value not drawn)
C28  100uF  [100uF 1210 SMD]
C29  100uF  [100uF 1210 SMD]
C30  10PF  [CAPC-0603 (1608)]
C31  33PF  [CAPC-0603 (1608)]
C32  0.1UF  [CAPC-0603 (1608)]
C33  1UF  [CAPC-0603 (1608)]
C34  10PF  [CAPC-0603 (1608)]
C35  10PF  [CAPC-0603 (1608)]
C38  NF  [CAPC-0603 (1608)]
C39  NF  [CAPC-0603 (1608)]
C46  NF  [CAPC-0603 (1608)]
C47  NF  [CAPC-0603 (1608)]
C48  NF  [CAPC-0603 (1608)]
C49  NF  [CAPC-0603 (1608)]
C50  NF  [CAPC-0603 (1608)]
D10  RED  [LED_0603_RED]
J1  USB_M  [USB_M]
Q2  2SC1815  [SOT23_3]
Q3  2SC1815  [SOT23_3]
R27  NF  [RESC-0603 (1608)]
R28  NF  [RESC-0603 (1608)]
R29  NF  [RESC-0603 (1608)]
R30  NF  [RESC-0603 (1608)]
R31  NF  [RESC-0603 (1608)]
R32  NF  [RESC-0603 (1608)]
R34  NF  [RESC-0603 (1608)]
R35  NF  [RESC-0603 (1608)]
R36  NF  [RESC-0603 (1608)]
R37  NF  [RESC-0603 (1608)]
R38  NF  [RESC-0603 (1608)]
R47  NF  [RESC-0603 (1608)]
R48  NF  [RESC-0603 (1608)]
R49  NF  [RESC-0603 (1608)]
S1  SOCKET SIM C7801  [SOCKET SIM]
U6  Module Sim A7670C  [Module Sim A7670C]
U7  SMF05CT2G  [SOT65P210X140-6N]
U8  TXS0108E  [TXS0108E]

### Ports
MCU_PIN_CTR_RI, MCU_PIN_RX1_SIM, MCU_PIN_TX1_SIM, PWR_3 (harness PWR_X3), PWR_KEY_FR_MCU, RESET_PIN_FR_MCU

### Harnesses
PWR_X3: VCC_12V, VCC_5V, VCC_3.3V

### Nets
GND: C28.1 C29.1 C30.1 C31.1 C32.1 C33.1 C35.1 C38.1 C39.1 C46.1 C47.1 C48.1 C49.1 C50.1 J1.5(GND) Q2.2(E) Q3.2(E) R27.1 R30.2 R31.2 R34.1 R35.2 S1.5(GND) U6.2(GND) U6.17(GND) U6.18(GND) U6.29(GND) U6.39(GND) U6.45(GND) U6.46(GND) U6.54(GND) U6.58(GND) U6.59(GND) U6.61(GND) U6.62(GND) U6.63(GND) U6.64(GND) U6.65(GND) U7.2(AN)
MCU_PIN_CTR_RI: U8.17(B3) ; port MCU_PIN_CTR_RI
MCU_PIN_RX1_SIM: U8.20(B1) ; port MCU_PIN_RX1_SIM
MCU_PIN_TX1_SIM: U8.18(B2) ; port MCU_PIN_TX1_SIM
NET_LIGHT: D10.1(A) U6.52(NETLIGHT)
PWR_KEY_FR_MCU: R29.2 ; port PWR_KEY_FR_MCU
PWR_KEY_PIN: Q3.3(C) U6.1(PWRKEY)
RESET_PIN: Q2.3(C) U6.16(RESET)
RESET_PIN_FR_MCU: R28.2 ; port RESET_PIN_FR_MCU
RF_ANT: C38.2 R32.2 U6.60(RF_ANT)
RI: U6.4(RI) U8.4(A3)
RXD: U6.10(RXD) U8.3(A2)
SIM_CLK: C47.2 R37.2 U6.32(SIM_CLK)
SIM_DATA: C46.2 R38.2 U6.31(SIM_DATA)
SIM_RST: C48.2 R36.2 U6.33(SIM_RST)
SIM_VDD: C49.2 C50.2 S1.1(VCC) U6.30(SIM_VDD) U7.6(CT5)
TXD: U6.9(TXD) U8.1(A1)
USB_N: R47.2 U6.28(USB_DM)
USB_P: R48.2 R49.1 U6.27(USB_DP)
VBATT: C28.2 C29.2 C30.2 C31.2 C32.2 C33.2 U6.55(VBAT) U6.56(VBAT) U6.57(VBAT) ; port PWR_3.VCC_5V  [also labelled VCC_5V_FOR_ALL]
VBUS: J1.1(VCC) R49.2 U6.24(VBUS)
VCC_3.3V_MCU: C34.2 U8.19(VCCB) ; port PWR_3.VCC_3.3V
VDD_EXT_1V8: U6.15(VDD_EXT_1V8) U8.2(VCCA)
NetAT1_1: AT1.1(AT) C39.2 R32.1
NetC34_1: C34.1 U8.11(GND)
NetC35_2: C35.2 U8.10(OE)
NetD10_2: D10.2(K) R27.2
NetJ1_2: J1.2(D-) R47.1
NetJ1_3: J1.3(D+) R48.1
NetQ2_1: Q2.1(B) R28.1 R30.1
NetQ3_1: Q3.1(B) R29.1 R31.1
NetR34_2: R34.2 U8.9(A8)
NetR35_1: R35.1 U8.12(B8)
NetR36_1: R36.1 S1.2(RST) U7.5(CT4)
NetR37_1: R37.1 S1.3(CLK) U7.4(CT3)
NetR38_1: R38.1 S1.7(IO) U7.3(CT2)

Not connected (* = marked no-connect by the designer): AT1 2; J1 4(ID)*; S1 6(VPP)*; U6 3(DTR)* 5(DCD)* 6(USB_BOOT)* 7(CTS)* 8(RTS)* 11(PCM_CLK)* 12(PCM_SYNC)* 13(PCM_DIN)* 14(PCM_OUT)* 19(GPIO1)* 20(GPIO2)* 21(GPIO3)* 22(UART_LOG_RX)* 23(UART_LOG_TX)* 25(ADC)* 26(NC)* 34(SIM_DET) 35(NC)* 36(NC)* 37(I2C_SDA)* 38(I2C_SCL)* 40(NC)* 41(NC)* 42(NC)* 43(NC)* 44(NC)* 47(NC)* 48(GPIO9)* 49(GPIO4)* 50(GPIO5)* 51(NC)* 53(NC)* 66(STATUS)* 67(GPIO10)* 68(GPIO11)*; U7 1(CT1)*; U8 5(A4)* 6(A5)* 7(A6)* 8(A7)* 13(B7)* 14(B6)* 15(B5)* 16(B4)*

### Layout directives
differential pair; net class USB_CLS: USB_N, USB_P

### Notes on the sheet
- (in symbol Module Sim A7670C) SIM7670

### Library data of the parts
AT1 = RFCON171003SF6B001: CONNECTER ANTENNA GPS GSM; Solder: HAND; CompanyID: VT-00392; MPN: RFCON171003SF6B001; Value: AT-GSM-GPS
C28 C29 = CAP SMD 1210 100uF
C30-C35 = CAPC NF 0603: CAP SMD, Not Fill, 0603; Value: NF; Solder: Not Fill; Category: CAPACITOR
C38 C39 C46-C50 = CAPC NF 0603: CAP SMD, Not Fill, 0603; Solder: Not Fill; Value: NF; Category: CAPACITOR
D10 = LED RED 0603: LED RED 0603 SMD; Solder: SMT; Value: RED; Category: *
Q2 Q3 = 2SC1815: TRANS NPN 50V 0.15A SOT23-3; Solder: SMT; MPN: 2SC1815; Value: 2SC1815
R27-R32 R34-R38 R47-R49 = RESC NF 0603: RES SMD, Not Fill, 0603; Solder: Not Fill; Value: NF; Category: RESISTOR
U7 = SMF05C: TVS Diode Array For ESD and Latch-Up Protection; MFR: ON SEMICONDUCTOR; Solder: SMT; CompanyID: VT-0; MPN: SMF05CT2G; Category: IC; Value: SMF05CT2G

## Sheet [F_V1]_Sensors_And_BlockControl_Sheet.SchDoc
size A2; SheetNumber: 5; SheetTotal: 5
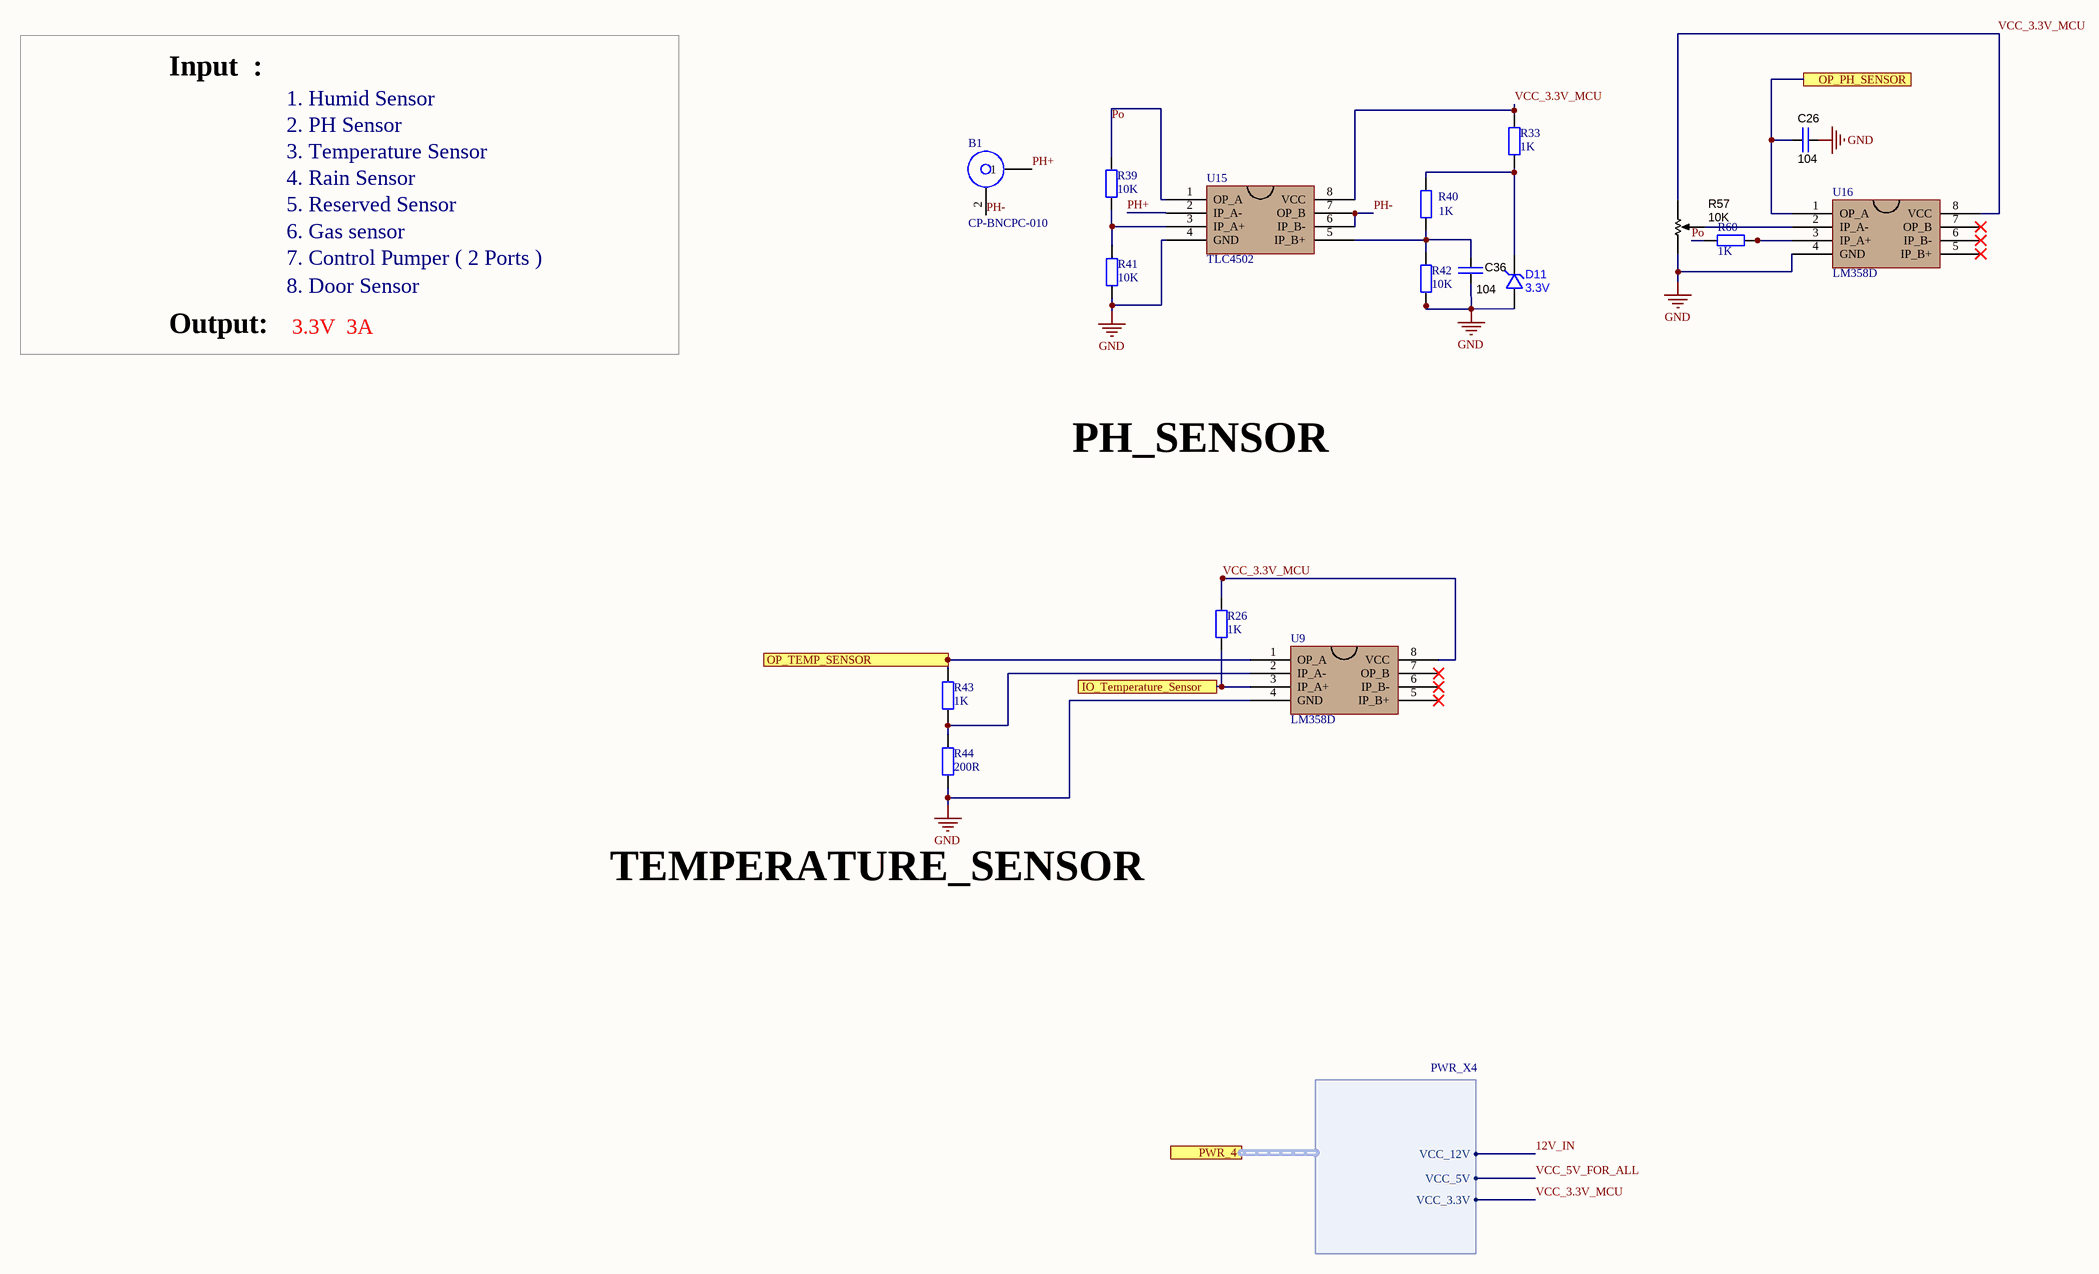
[diagram p6: [F_V1]_Sensors_And_BlockControl_Sheet.SchDoc]

### Parts
B1  CP-BNCPC-010  [BNC]
C26  104  [CAPC1608X90N]
C36  104  [CAPC1608X90N]
D11  3.3V  [SOD323]
R26  1K  [RESC-0603 (1608)]
R33  1K  [RESC-0603 (1608)]
R39  10K  [RESC-0603 (1608)]
R40  1K  [RESC-0603 (1608)]
R41  10K  [RESC-0603 (1608)]
R42  10K  [RESC-0603 (1608)]
R43  1K  [RESC-0603 (1608)]
R44  200R  [RESC-0603 (1608)]
R57  value 10K  [TrimPot_THT_2.54mm pitch]  (hidden comment: 25 Turn)
R60  1K  [RESC-0603 (1608)]
U9  LM358D  [LM358]
U15  TLC4502  [TLC4502]
U16  LM358D  [LM358]

### Ports
IO_Temperature_Sensor, OP_PH_SENSOR, OP_TEMP_SENSOR, PWR_4 (harness PWR_X4)

### Harnesses
PWR_X4: VCC_12V, VCC_5V, VCC_3.3V

### Nets
GND: C26.2 C36.2 D11.A R41.1 R42.1 R44.1 R57.1(CCW) U9.4(GND) U15.4(GND) U16.4(GND)
IO_Temperature_Sensor: R26.1 U9.3(IP_A+) ; port IO_Temperature_Sensor
OP_PH_SENSOR: C26.1 U16.1(OP_A) ; port OP_PH_SENSOR
OP_TEMP_SENSOR: R43.2 U9.1(OP_A) ; port OP_TEMP_SENSOR
PH+: B1.1 U15.2(IP_A-)
PH-: B1.2 U15.6(IP_B-) U15.7(OP_B)
Po: R39.2 R60.2 U15.1(OP_A)
VCC_3.3V_MCU: R26.2 R33.2 R57.3(CW) U9.8(VCC) U15.8(VCC) U16.8(VCC) ; port PWR_4.VCC_3.3V
NetC36_1: C36.1 R40.1 R42.2 U15.5(IP_B+)
NetD11_K: D11.K R33.1 R40.2
NetR39_1: R39.1 R41.2 U15.3(IP_A+)
NetR43_1: R43.1 R44.2 U9.2(IP_A-)
NetR57_2: R57.2(TAP) U16.2(IP_A-)
NetR60_1: R60.1 U16.3(IP_A+)

Not connected (* = marked no-connect by the designer): U9 5(IP_B+)* 6(IP_B-)* 7(OP_B)*; U16 5(IP_B+)* 6(IP_B-)* 7(OP_B)*

### Notes on the sheet
- Input  :
- 1. Humid Sensor
- 2. PH Sensor
- 3. Temperature Sensor
- 4. Rain Sensor
- 5. Reserved Sensor
- 6. Gas sensor
- 7. Control Pumper ( 2 Ports )
- 8. Door Sensor
- Output:
- 3.3V  3A
- PH_SENSOR
- TEMPERATURE_SENSOR

### Library data of the parts
C26 C36 = CAP C_0603: Capacitor SMD Cer 470nF 10% 16V X7R 0603; Manufacturer 1: Murata Electronics North America; Manufacturer Part Number 1: GRM188R71C474KA88D; Ratings: 16V; X7R; Material: ceramic; SCDType: spec; Package / Case: 0603 (1608 metric); Tolerance: ±10%; Manufacturer 2: TDK Corporation; Manufacturer Part Number 2: C1608X7R1C474K; Supplier 1: Digi-Key; Supplier Part Number 1: 490-3295-2-ND; Supplier 2: Digi-Key; Supplier Part Number 2: 445-5192-2-ND; Supplier 3: Digi-Key; Supplier Part Number 3: 587-1250-2-ND; Manufacturer 3: Taiyo Yuden; Manufacturer Part Number 3: EMK107B7474KA-T; Manufacturer 4: Samsung; Manufacturer Part Number 4: CL10B474KONE; ComponentLink1URL: http://psearch.murata.com/capacitor/product/GRM188R71C474KA88#.pdf; ComponentLink1Description: http://psearch.murata.com/capacitor/product/GRM188R71C474KA88#.pdf; ComponentLink2URL: http://product.tdk.com/capacitor/mlcc/en/documents/mlcc_commercial_general_en.pdf; ComponentLink2Description: http://product.tdk.com/capacitor/mlcc/en/documents/mlcc_commercial_general_en.pdf; ComponentLink3URL: http://www.yuden.co.jp/or/product/category/capacitor/EMK107B7474KA-T.pdf; ComponentLink3Description: http://www.yuden.co.jp/or/product/category/capacitor/EMK107B7474KA-T.pdf; Value: 104
D11 = DIODE_ZENER_3V3_SOD323: Diode Zener SMD 3.3V 200mW SOD-323; Manufacturer 1: ON Semiconductor; Manufacturer Part Number 1: MM3Z3V3ST1G; Ratings: 3.3V; 0.2W; Vf=900mV @ 10mA; Material: Si; Tolerance: ±3%; SCDType: source; Package / Case: SOD-323; Diode Type: Zener; Supplier 1: Digi-Key; Supplier Part Number 1: MM3Z3V3ST1GOSCT-ND
R26 R33 R39-R44 R60 = CRCW06035R10FKEA: as R1 on sheet [F_V1]_PowerSheet; MPN: CRCW06035R10FKEA; Category: RESISTOR; PinCount: 2
R57 = RES_TRIMMER_1K_25T_THT: Trimmer, 25-Turn, 1K cermet; Manufacturer 1: Murata Electronics North America; Manufacturer Part Number 1: PV36Y102C01B00; Tolerance: 10%; Ratings: 25 turn variable cermet; SCDType: spec; Supplier 1: Digi-Key; Supplier Part Number 1: 490-2912-ND

## Nets that join several sheets
GND: [F_V1]_PowerSheet (42 pins), [F_V1]MCU_Sheet (26 pins), [F_V1]_CommMunication_Sheet (39 pins), [F_V1]_Sensors_And_BlockControl_Sheet (10 pins)
IO_Light_UV_Sensor: [F_V1]_PowerSheet (JP1#1.10), [F_V1]MCU_Sheet (U5.14)
IO_Rain_Sensor: [F_V1]_PowerSheet (JP1#1.12 R51.2), [F_V1]MCU_Sheet (U5.15)
IO_Soil_Sensor: [F_V1]_PowerSheet (JP1#1.14 R50.2), [F_V1]MCU_Sheet (U5.16)
IO_Temperature_Sensor: [F_V1]_PowerSheet (JP1#1.20), [F_V1]_Sensors_And_BlockControl_Sheet (R26.1 U9.3)
MCU_PIN_CTR_N1: [F_V1]_PowerSheet (JP1#1.2), [F_V1]MCU_Sheet (U5.10)
MCU_PIN_CTR_N2: [F_V1]_PowerSheet (JP1#1.4), [F_V1]MCU_Sheet (U5.11)
MCU_PIN_CTR_RI: [F_V1]MCU_Sheet (U5.41), [F_V1]_CommMunication_Sheet (U8.17)
MCU_PIN_I2C2_SCA: [F_V1]_PowerSheet (JP1#1.18), [F_V1]MCU_Sheet (U5.22)
MCU_PIN_I2C2_SCL: [F_V1]_PowerSheet (JP1#1.16), [F_V1]MCU_Sheet (U5.21)
MCU_PIN_RX1_SIM: [F_V1]MCU_Sheet (U5.43), [F_V1]_CommMunication_Sheet (U8.20)
MCU_PIN_RX2_DB: [F_V1]_PowerSheet (JP1#1.8), [F_V1]MCU_Sheet (U5.13)
MCU_PIN_TX1_SIM: [F_V1]MCU_Sheet (U5.42), [F_V1]_CommMunication_Sheet (U8.18)
MCU_PIN_TX2_DB: [F_V1]_PowerSheet (JP1#1.6), [F_V1]MCU_Sheet (U5.12)
OP_PH_SENSOR: [F_V1]MCU_Sheet (U5.19), [F_V1]_Sensors_And_BlockControl_Sheet (C26.1 U16.1)
OP_TEMP_SENSOR: [F_V1]MCU_Sheet (U5.17), [F_V1]_Sensors_And_BlockControl_Sheet (R43.2 U9.1)
PWR_KEY_FR_MCU: [F_V1]MCU_Sheet (U5.45), [F_V1]_CommMunication_Sheet (R29.2)
RESET_PIN_FR_MCU: [F_V1]MCU_Sheet (U5.46), [F_V1]_CommMunication_Sheet (R28.2)
VBATT: [F_V1]_PowerSheet (11 pins), [F_V1]MCU_Sheet (R45.1), [F_V1]_CommMunication_Sheet (9 pins)
VCC_3.3V_MCU: [F_V1]_PowerSheet (6 pins), [F_V1]MCU_Sheet (16 pins), [F_V1]_CommMunication_Sheet (C34.2 U8.19), [F_V1]_Sensors_And_BlockControl_Sheet (6 pins)